# Altium project ECEN 404 Schematic.PrjPcb
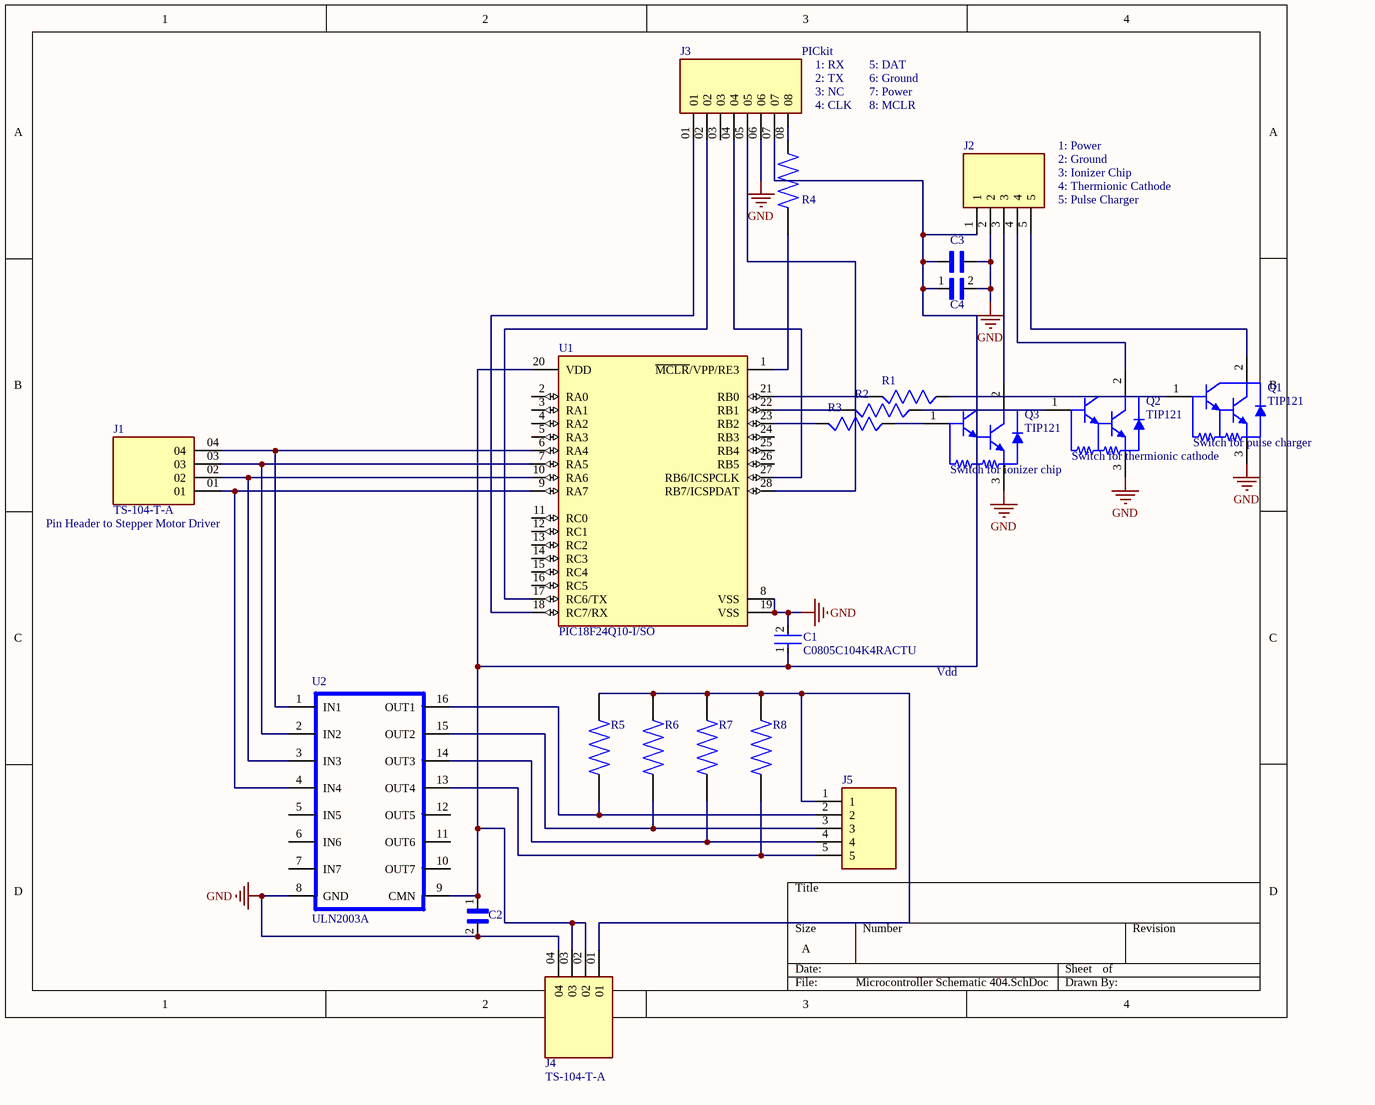
[diagram p0: Microcontroller Schematic 404.SchDoc]
1 sheet, 22 parts. Net scope: global (net labels, ports and power ports of the same name join across sheets).
Board file: Microcontroller PCB 404.PcbDoc

## Sheet Microcontroller Schematic 404.SchDoc
size A; SheetNumber: 1; SheetTotal: 1

### Parts
C1  C0805C104K4RACTU  [CAPC2012X100N]
C2  C0805C104K4RACTU  [CAPC2012X100N]  (value not drawn)
C3  C2012X7S0J106M085AC  [CAPC2012X100N]  (value not drawn)
C4  GRM21BR60J107ME15K  [FP-C0805C-DN-MFG]  (value not drawn)
J1  TS-104-T-A  [SAMTEC_TS-104-T-A]
J2  Comment  [PCBComponent_1]  (value not drawn)
J3  TS-108-X-A-1  [SAMTEC_TS-108-X-A-1]  (value not drawn)
J4  TS-104-T-A  [SAMTEC_TS-104-T-A]
J5  Comment  [TE_440052-5]  (value not drawn)
Q1  TIP121  [ONSC-TO-220-3-221A-09]
Q2  TIP121  [ONSC-TO-220-3-221A-09]
Q3  TIP121  [ONSC-TO-220-3-221A-09]
R1  RC0805FR-07205RL  [RESC2012X60]  (value not drawn)
R2  RC0805FR-07205RL  [RESC2012X60]  (value not drawn)
R3  RC0805FR-07205RL  [RESC2012X60]  (value not drawn)
R4  RMCF0805JT10K0  [RESC2012X65N]  (value not drawn)
R5  Comment  (value not drawn)
R6  Comment  (value not drawn)
R7  Comment  (value not drawn)
R8  Comment  (value not drawn)
U1  PIC18F24Q10-I/SO  [FP-C04-052-IPC_A]
U2  ULN2003A  [DIP762W51P254L1992H425Q16]

### Nets
GND: C1.2 C2.2 C3.2 C4.2 J2.2 J3.06 J4.04 Q1.3(E) Q2.3(E) Q3.3(E) U1.8(VSS) U1.19(VSS) U2.8(GND)
NetC1_1: C1.1 C2.1 C3.1 C4.1 J2.1 J3.07 J4.02 J4.03 U1.20(VDD) U2.9(CMN)
NetJ1_01: J1.01 U1.9(RA7) U2.4(IN4)
NetJ1_02: J1.02 U1.10(RA6) U2.3(IN3)
NetJ1_03: J1.03 U1.7(RA5) U2.2(IN2)
NetJ1_04: J1.04 U1.6(RA4) U2.1(IN1)
NetJ2_3: J2.3 Q3.2(C)
NetJ2_4: J2.4 Q2.2(C)
NetJ2_5: J2.5 Q1.2(C)
NetJ3_01: J3.01 U1.18(RC7/RX)
NetJ3_02: J3.02 U1.17(RC6/TX)
NetJ3_04: J3.04 U1.27(RB6/ICSPCLK)
NetJ3_05: J3.05 U1.28(RB7/ICSPDAT)
NetJ3_08: J3.08 R4.2
NetJ4_01: J4.01 J5.1 R5.2 R6.2 R7.2 R8.2
NetJ5_2: J5.2 R5.1 U2.16(OUT1)
NetJ5_3: J5.3 R6.1 U2.15(OUT2)
NetJ5_4: J5.4 R7.1 U2.14(OUT3)
NetJ5_5: J5.5 R8.1 U2.13(OUT4)
NetQ1_1: Q1.1(B) R1.2
NetQ2_1: Q2.1(B) R2.2
NetQ3_1: Q3.1(B) R3.2
NetR1_1: R1.1 U1.21(RB0)
NetR2_1: R2.1 U1.22(RB1)
NetR3_1: R3.1 U1.23(RB2)
NetR4_1: R4.1 U1.1(~{MCLR}/VPP/RE3)

Not connected (* = marked no-connect by the designer): J3 03; U1 2(RA0) 3(RA1) 4(RA2) 5(RA3) 11(RC0) 12(RC1) 13(RC2) 14(RC3) 15(RC4) 16(RC5) 24(RB3) 25(RB4) 26(RB5); U2 5(IN5) 6(IN6) 7(IN7) 10(OUT7) 11(OUT6) 12(OUT5)

### Notes on the sheet
- PICkit
- (near J3) 1: RX
- (near J3) 3: NC
- (near J3) 2: TX
- 5: DAT
- 6: Ground
- 7: Power
- (near J3) 4: CLK
- 8: MCLR
- 1: Power
- (near J2) 2: Ground
- (near J2) 3: Ionizer Chip
- (near J2) 4: Thermionic Cathode
- (near J2) 5: Pulse Charger
- (near Q3) Switch for ionizer chip
- (near Q2) Switch for thermionic cathode
- (near Q1) Switch for pulse charger
- (near J1) Pin Header to Stepper Motor Driver
- Vdd

### Library data of the parts
C1 = CMP-2007-00274-2: CAP CER 0.1UF 16V X7R 0805; Manufacturer: KEMET; Material: Ceramic; Tolerance: 0.1; Capacitance: 0.10 μF; Value: 0.10 μF; Temperature Coefficient: 30ppm/°C; Device Class L3: Ceramic Capacitors; RoHS: TRUE; Octopart: https://octopart.com/c0805c104k4ractu-kemet-92155; ComponentLink2Description: Datasheet; ComponentLink2URL: https://content.kemet.com/datasheets/KEM_C1003_C0G_SMD.pdf; Temperature Range High: +125°C; Category: Cap; Lead Free: Yes; Digikey Description: CAP CER 0.1UF 16V X7R 0805; Automotive: No; Temperature Range Low: -55°C; Voltage Rating: 16 V; Package: C0805C-DN; Ipc Land Pattern Name: CAPC200125X78; Manufacturer Part Number: C0805C104K4RACTU; Height: 0.88mm; Device Class L1: Passive Components; Temperature: -55°C to +125°C; Mouser Description: Multilayer Ceramic Capacitors MLCC - SMD/SMT 16volts 0.1uF X7R 10%; Device Class L2: Capacitors; Temperature Characteristic: X7R
C2 = 08051C103KAT2A: 10000pF Â±10% 100V Ceramic Capacitor X7R 0805 (2012 Metric); MF: AVX; Purchase-URL: https://pricing.snapeda.com/search/part/08051C103KAT2A/?ref=eda; SnapEDA_Link: https://www.snapeda.com/parts/08051C103KAT2A/AVX/view-part/437183/?ref=snap; Price: None; MP: 08051C103KAT2A; Package: 2012 AVX; Value: *; Availability: Good; Check_prices: https://www.snapeda.com/parts/08051C103KAT2A/AVX/view-part/437183/?ref=eda
C3 = C2012X7S0J106M085AC: Cap Ceramic 10uF 6.3V X7S 20% SMD 0805 125Â°C Punched Paper T/R; MF: {'manufacturer': u'TDK Corporation'}; Package: None; Price: None; Value: *; MP: C2012X7S0J106M085AC; Availability: Unavailable
C4 = GRM21BR60J107ME15K: 0805 100 uF 6.3 V Â±20% Tolerance X7S Multilayer Ceramic Chip Capacitor; MF: Murata Electronics; Availability: In Stock; Price: None; SnapEDA_Link: https://www.snapeda.com/parts/GRM21BR60J107ME15K/Murata%20Electronics%20North%20America/view-part/1845859/?ref=snap; Value: *; Check_prices: https://www.snapeda.com/parts/GRM21BR60J107ME15K/Murata%20Electronics%20North%20America/view-part/1845859/?ref=eda; MP: GRM21BR60J107ME15K; Package: 2012 Murata
J1 J4 = TS-104-T-A: TS - Samtec 2.54mm Single Row Machined Terminal Strip - Fast Stock; MF: Samtec Inc.; Check_prices: https://www.snapeda.com/parts/TS-104-T-A/Samtec+Inc./view-part/?ref=eda; Value: *; Availability: In Stock; Price: None; Package: None; MP: TS-104-T-A; SnapEDA_Link: https://www.snapeda.com/parts/TS-104-T-A/Samtec+Inc./view-part/?ref=snap; Purchase-URL: https://pricing.snapeda.com/search/part/TS-104-T-A/?ref=eda
J2 = 282837-5: 5 position terminal block
J3 = TS-108-X-A-1: TS Series .100 Single Row Screw Machine Terminal Strip; MP: TS-108-G-A-1; MF: Samtec; Availability: Bad; Value: *; Check_prices: https://www.snapeda.com/parts/TS-108-G-A-1/Samtec/view-part/4699387/?ref=eda; Package: None; Price: None; SnapEDA_Link: https://www.snapeda.com/parts/TS-108-G-A-1/Samtec/view-part/4699387/?ref=snap
J5 = 440052-5: Connector Header Through Hole 5 position 0.098 _2.50mm_; MF: TE Connectivity; Package: None; Digi-Key_Part_Number: A145094-ND; EU_RoHS_Compliance: Compliant; MP: 440052-5; Digi-Key_Purchase_URL: https://www.digikey.com/product-detail/en/te-connectivity-amp-connectors/440052-5/A145094-ND/2188064?utm_source=snapeda&utm_medium=aggregator&utm_campaign=symbol; Value: *; TE_purchase_URL: https://www.te.com/usa-en/product-440052-5.html?te_bu=Cor&te_type=disp&te_campaign=seda_glo_cor-seda-global-disp-prtnr-fy19-seda-model-bom-cta_sma-317_1&elqCampaignId=32493; SnapEDA_Link: https://www.snapeda.com/parts/440052-5/TE%20Connectivity%20AMP%20Connectors/view-part/2409970/?ref=snap
Q1-Q3 = CMP-1047-00128-1: Plastic Medium-Power, Complementary Silicon Transistor, 3-Pin TO-220, Tube; Manufacturer: On Semiconductor; Polarity: NPN; IC Continuous (A): 5; ComponentLink1URL: http://www.onsemi.com/; PackageReference: TO-220-3-221A-09; ComponentLink1Description: Manufacturer URL; RoHS: FALSE; ComponentLink2URL: http://www.onsemi.cn/pub_link/Collateral/TIP120-D.PDF; PackageDescription: 3-Pin Flange Mount, Vertical Straight Lead, Body 9.97 x 4.445 mm, Pitch 2.54 mm; PackageVersion: Rev. AG, 09/2011; DatasheetVersion: Rev. 8; ComponentLink3URL: http://www.onsemi.com/pub_link/Collateral/221A-09.PDF; PartNumber: TIP121; ComponentLink2Description: Datasheet; Packing: Tube; ComponentLink3Description: Package Specification; Mounting Technology: Through Hole
R1-R3 = RC0805FR-07205RL: RC Series 0805 0.125 W 2 kOhms 5% Â±100 ppm/Â°C SMT Thick Film Chip Resistor; MF: {'manufacturer': u'YAGEO'}; Package: None; Price: None; Value: *; MP: RC0805FR-07205RL; Availability: Unavailable
R4 = RMCF0805JT10K0: 10 kOhms Â±5% 0.125W, 1/8W Chip Resistor 0805 (2012 Metric) Automotive AEC-Q200 Thick Film; MF: Stackpole Electronics Inc; Availability: Warning; Value: *; Price: None; DigiKey-Purchase-URL: https://snapeda.com/shop?store=DigiKey&id=3958697; SnapEDA_Link: https://www.snapeda.com/parts/RMCF0805JT10K0/Stackpole%20Electronics%20Inc/view-part/3958697/?ref=snap; MP: RMCF0805JT10K0; Package: 2012 Stackpole; BuyPart: https://www.snapeda.com/parts/RMCF0805JT10K0/Stackpole%20Electronics%20Inc/view-part/3958697/?ref=eda
R5-R8 = RCC08054K70FKEA: 4.7k ohm resistor
U1 = CMP-06276-000706-1: IC MCU 8BIT 16KB FLASH 28SOIC; Oscillator Type: Internal; Core Architecture: PIC; Number of I/Os: 25; Interface: I2C; Peripherals: Brown-out Detect/Reset; Frequency: 64MHz; Min Operating Temperature: -40°C; Case/Package: SOIC; Packaging: Rail/Tube; Memory Size: 16KB; Memory Type: FLASH; Series: PIC® XLP™ 18Q; Max Operating Temperature: 85°C
U2 = TCED4100: Optocoupler, Photodarlington Output, Dual Channel, High Gain; Package: None; Price: None; Value: *; MP: TCED4100; Availability: Unavailable